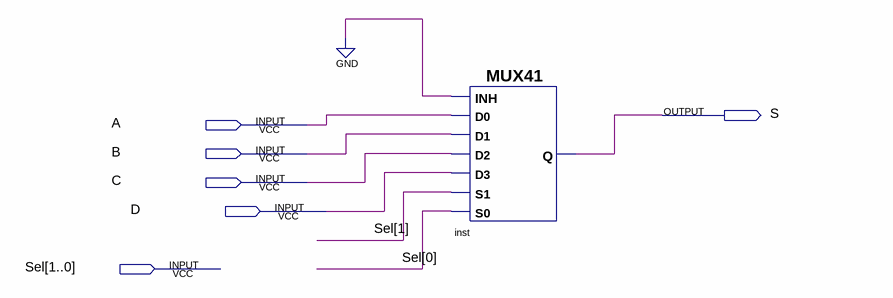
[diagram p0: schematic sheet]
// Quartus schematic MUX_41.bdf as structural Verilog: 1 symbols, 6 pins
module MUX_41 (
  input  A,
  input  B,
  input  C,
  input  D,
  input  [1:0] Sel,
  output S
);

  MUX41 inst (.S0(Sel[0]), .D2(C), .S1(Sel[1]), .D3(D), .D0(A), .INH(1'b0), .D1(B), .Q(S));
endmodule
